# EasyEDA Pro project Internal Chamber vr1.3.eprj

# Schematic _autosave-Internal Chamber
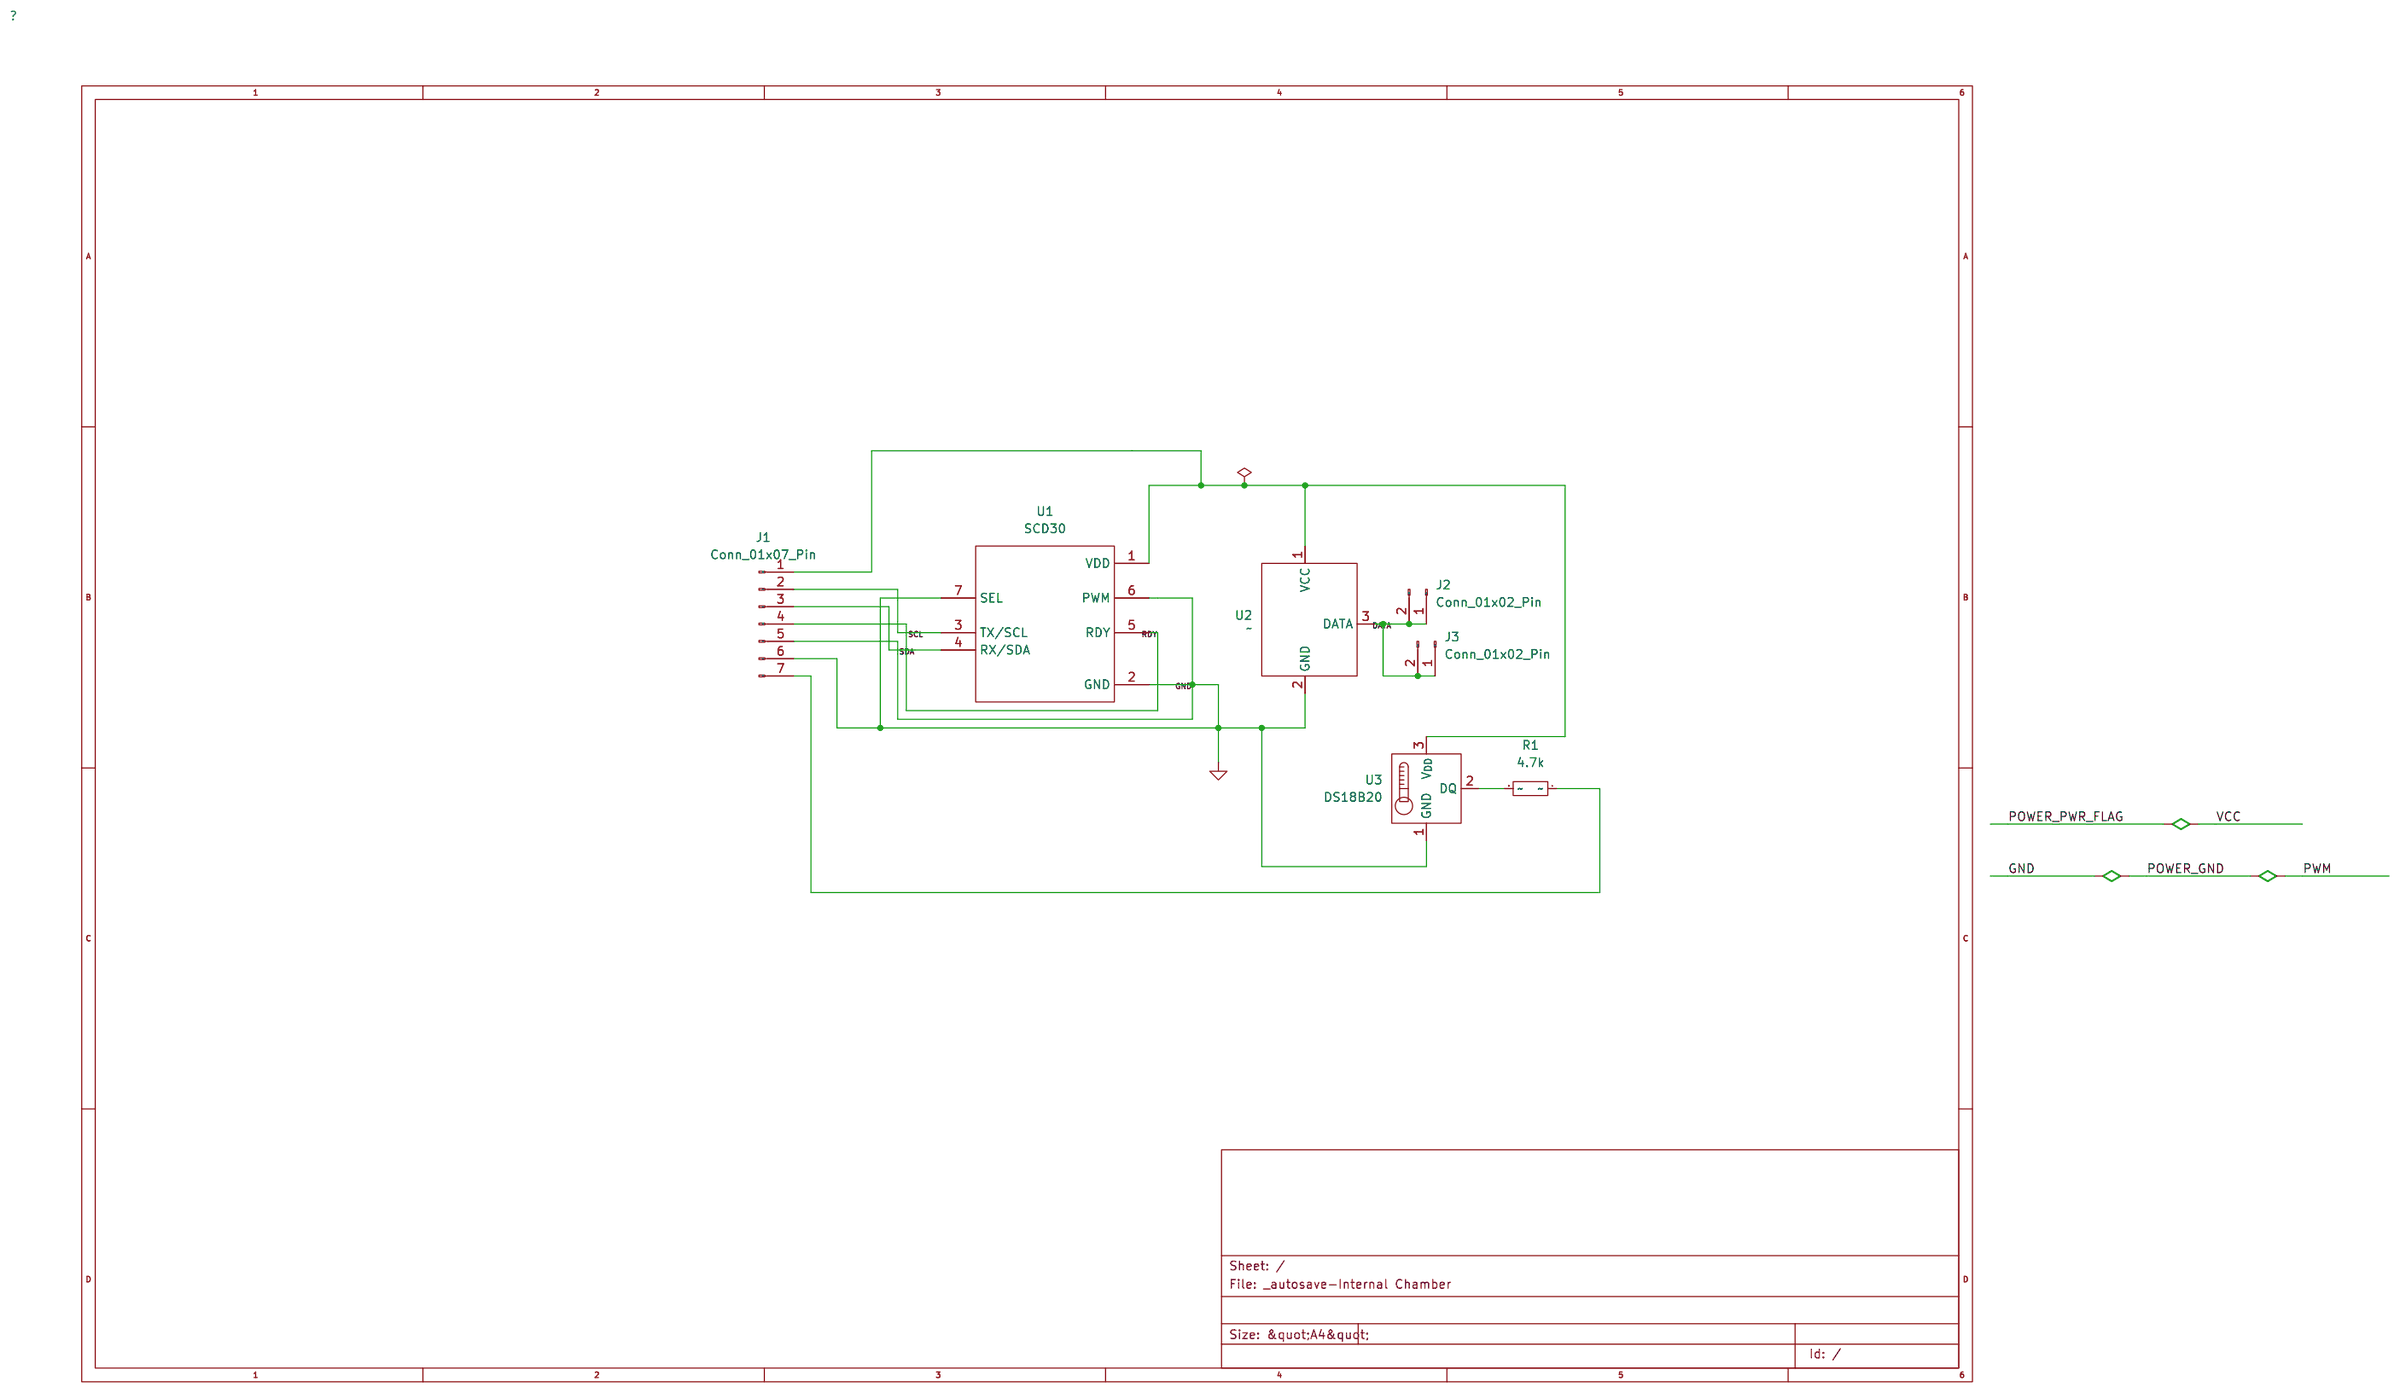
[diagram p0: schematic sheet]

## Parts
J1  Conn_01x07_Pin  [Connector_PinHeader_2.54mm:PinHeader_1x07_P2.54mm_Vertical]
J2  Conn_01x02_Pin  [Connector_PinSocket_2.54mm:PinSocket_1x02_P2.54mm_Vertical]
J3  Conn_01x02_Pin  [Connector_PinSocket_2.54mm:PinSocket_1x02_P2.54mm_Vertical]
R1  4.7k  [Resistor_THT:R_Axial_DIN0207_L6.3mm_D2.5mm_P15.24mm_Horizontal]
U1  SCD30  [SCD30 Footprint:MODULE_SCD30]
U2  -  [CO2_Sensor_IDE]
U3  DS18B20  [Package_TO_SOT_THT:TO-92_Inline]

## Library data of the parts
J1 = Connector_Conn_01x07_Pin: Generic connector, single row, 01x07, script generated
J2 J3 = Connector_Conn_01x02_Pin: Generic connector, single row, 01x02, script generated
R1 = Device_R: Resistor
U1 = SCD30_SCD30: MF: Sensirion AG; MAXIMUM_PACKAGE_HEIGHT: 7.0mm; Price: None; Check_prices: https://www.snapeda.com/parts/SCD30/Sensirion+AG/view-part/?ref=eda; STANDARD: Manufacturer Recommendations; PARTREV: D1; SnapEDA_Link: https://www.snapeda.com/parts/SCD30/Sensirion+AG/view-part/?ref=snap; Description_1: \n                        \n                            Carbon Dioxide (CO2), Humidity, Temperature Sensor I2C, Modbus, PWM\n                        \n; Availability: In Stock; MANUFACTURER: Sensirion
U2 = CO2_Sensor_IDE_CO2-Sensor-IDE
U3 = Sensor_Temperature_DS18B20: Programmable Resolution 1-Wire Digital Thermometer TO-92; User doc link: http://datasheets.maximintegrated.com/en/ds/DS18B20.pdf

## Nets
DATA: J2.1(Pin) J2.2(Pin) J3.1(Pin) J3.2(Pin) U2.3(DATA)
POWER_GND: J1.5(Pin) J1.6(Pin) U1.2(GND) U1.6(PWM) U1.7(SEL) U2.2(GND) U3.1(GND)
POWER_PWR_FLAG: J1.1(Pin) U1.1(VDD) U2.1(VCC) U3.3(V_{DD})
RDY: J1.4(Pin) U1.5(RDY)
SCL: J1.2(Pin) U1.3(TX/SCL)
SDA: J1.3(Pin) U1.4(RX/SDA)
Net-(J1-7): J1.7(Pin) R1.1
Net-(R1-2): R1.2 U3.2(DQ)

# Schematic Internal Chamber
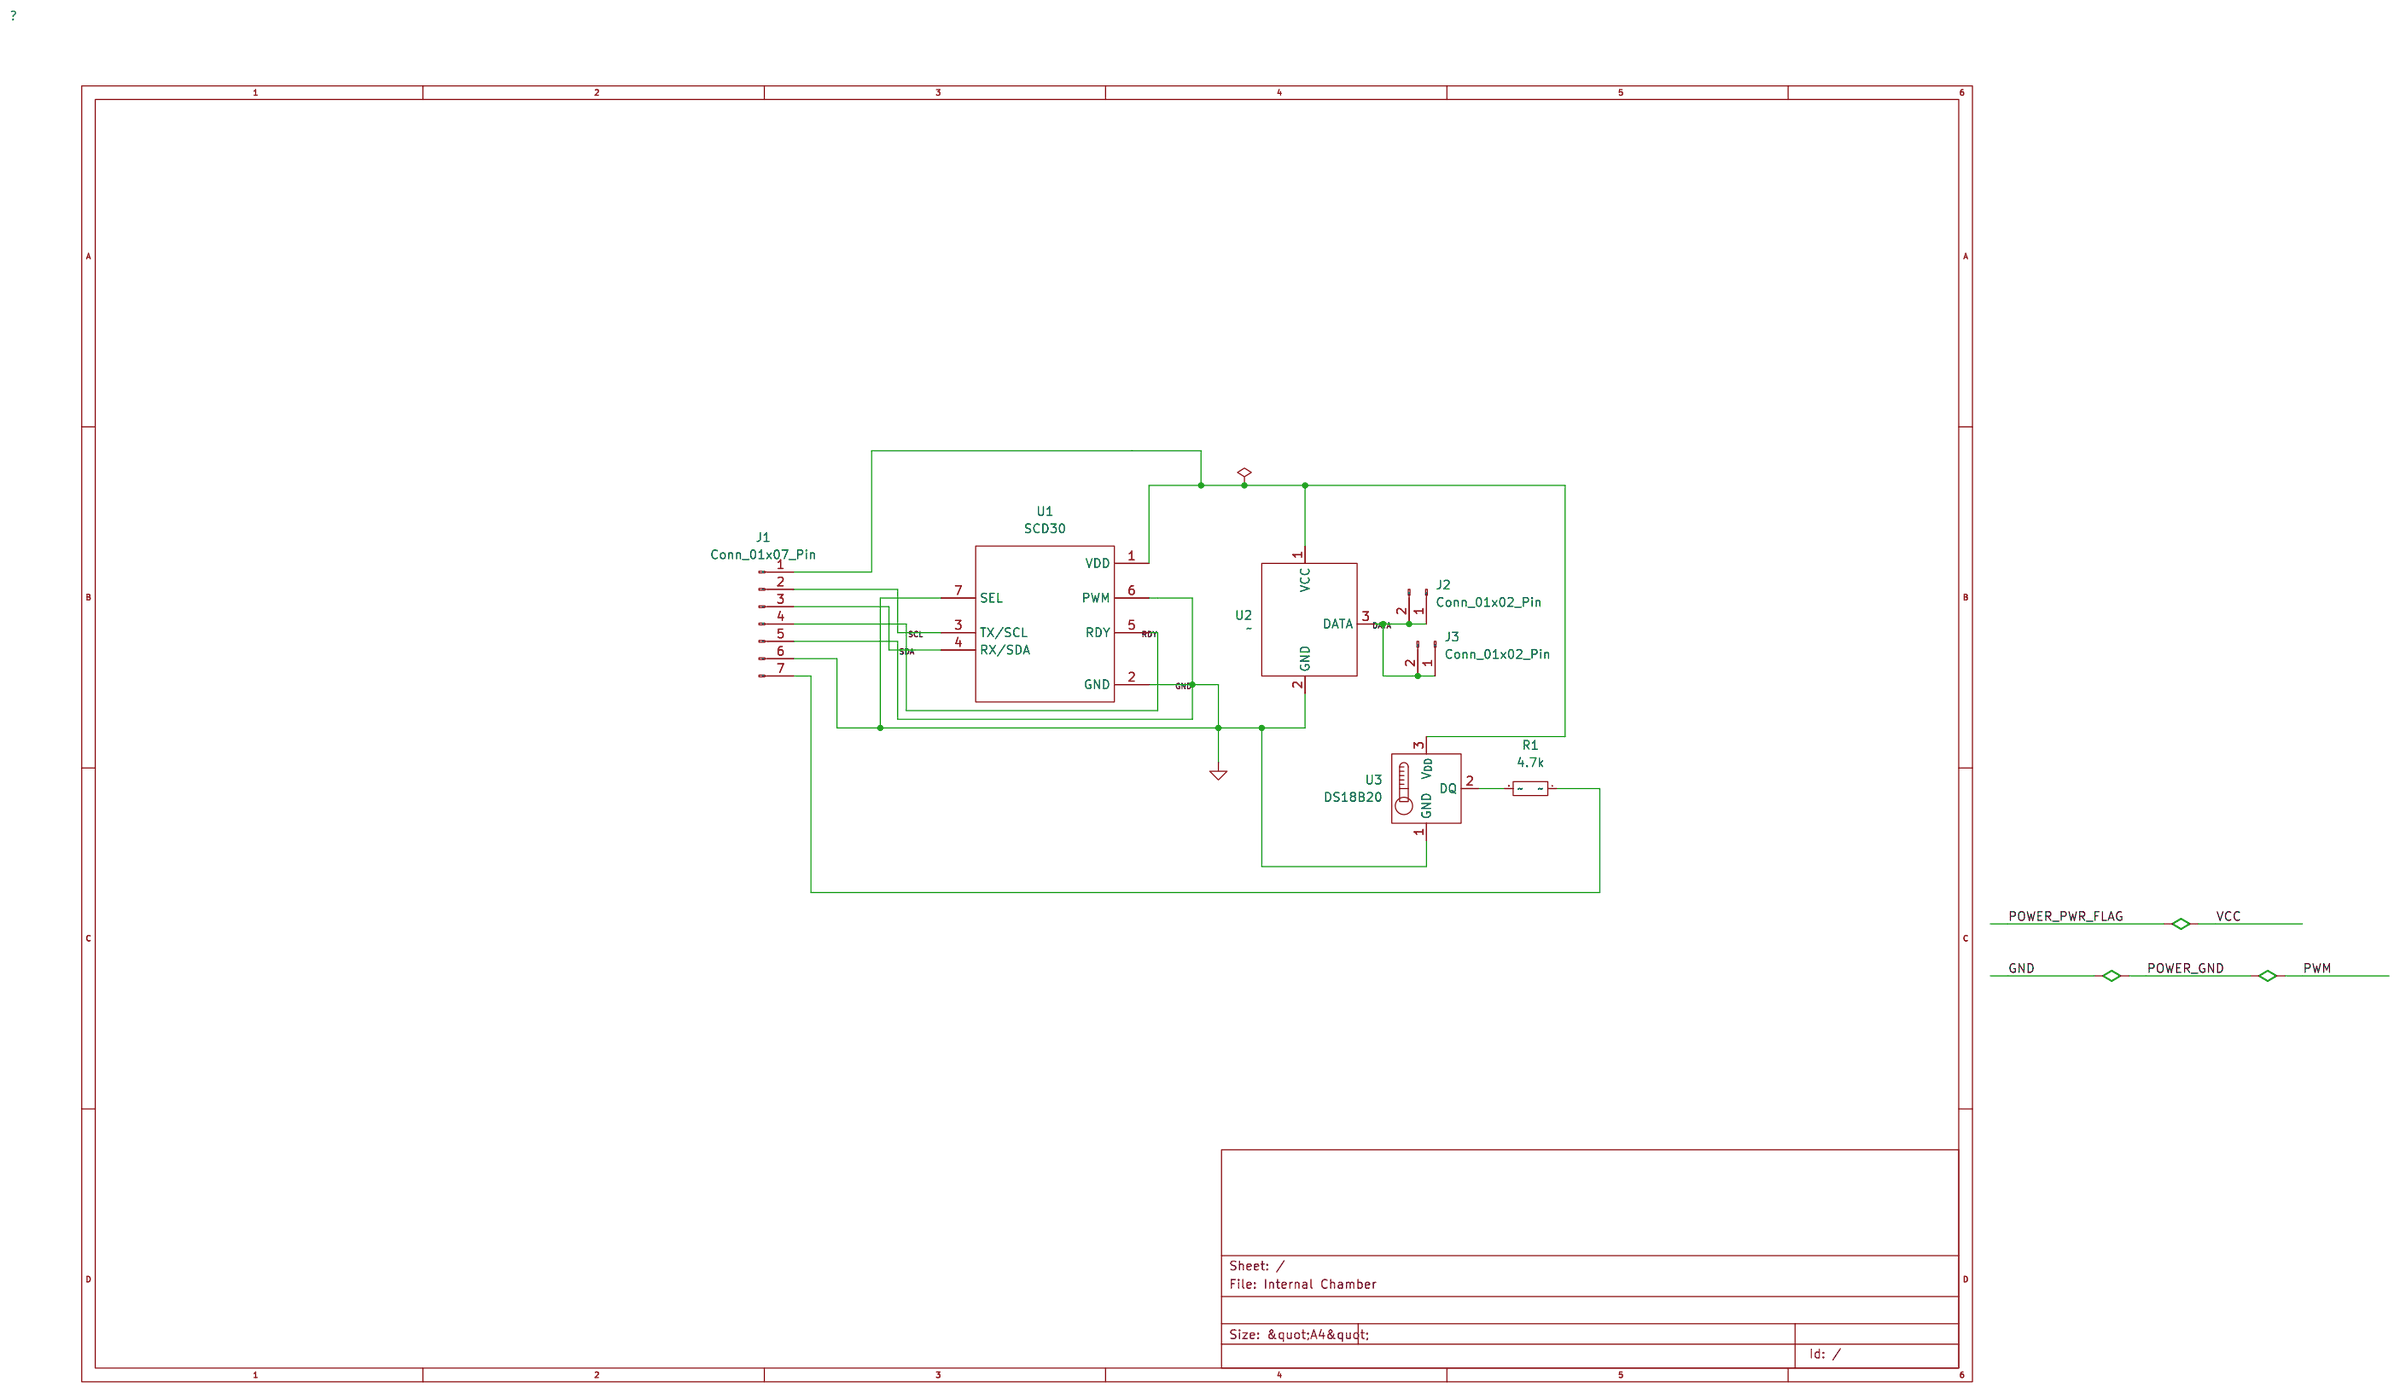
[diagram p1: schematic sheet]

## Parts
J1  Conn_01x07_Pin  [Connector_PinHeader_2.54mm:PinHeader_1x07_P2.54mm_Vertical]
J2  Conn_01x02_Pin  [Connector_PinSocket_2.54mm:PinSocket_1x02_P2.54mm_Vertical]
J3  Conn_01x02_Pin  [Connector_PinSocket_2.54mm:PinSocket_1x02_P2.54mm_Vertical]
R1  4.7k  [Resistor_THT:R_Axial_DIN0207_L6.3mm_D2.5mm_P15.24mm_Horizontal]
U1  SCD30  [SCD30 Footprint:MODULE_SCD30]
U2  -  [CO2_Sensor_IDE]
U3  DS18B20  [Package_TO_SOT_THT:TO-92_Inline]

## Library data of the parts
J1 = Connector_Conn_01x07_Pin: Generic connector, single row, 01x07, script generated
J2 J3 = Connector_Conn_01x02_Pin: Generic connector, single row, 01x02, script generated
R1 = Device_R: Resistor
U1 = SCD30_SCD30: MF: Sensirion AG; MAXIMUM_PACKAGE_HEIGHT: 7.0mm; Price: None; Check_prices: https://www.snapeda.com/parts/SCD30/Sensirion+AG/view-part/?ref=eda; STANDARD: Manufacturer Recommendations; PARTREV: D1; SnapEDA_Link: https://www.snapeda.com/parts/SCD30/Sensirion+AG/view-part/?ref=snap; Description_1: \n                        \n                            Carbon Dioxide (CO2), Humidity, Temperature Sensor I2C, Modbus, PWM\n                        \n; Availability: In Stock; MANUFACTURER: Sensirion
U2 = CO2_Sensor_IDE_CO2-Sensor-IDE
U3 = Sensor_Temperature_DS18B20: Programmable Resolution 1-Wire Digital Thermometer TO-92; User doc link: http://datasheets.maximintegrated.com/en/ds/DS18B20.pdf

## Nets
DATA: J2.1(Pin) J2.2(Pin) J3.1(Pin) J3.2(Pin) U2.3(DATA)
POWER_GND: J1.5(Pin) J1.6(Pin) U1.2(GND) U1.6(PWM) U1.7(SEL) U2.2(GND) U3.1(GND)
POWER_PWR_FLAG: J1.1(Pin) U1.1(VDD) U2.1(VCC) U3.3(V_{DD})
RDY: J1.4(Pin) U1.5(RDY)
SCL: J1.2(Pin) U1.3(TX/SCL)
SDA: J1.3(Pin) U1.4(RX/SDA)
NET-(J1-PIN_7): J1.7(Pin) R1.1
NET-(U3-DQ): R1.2 U3.2(DQ)

# Board Internal Chamber
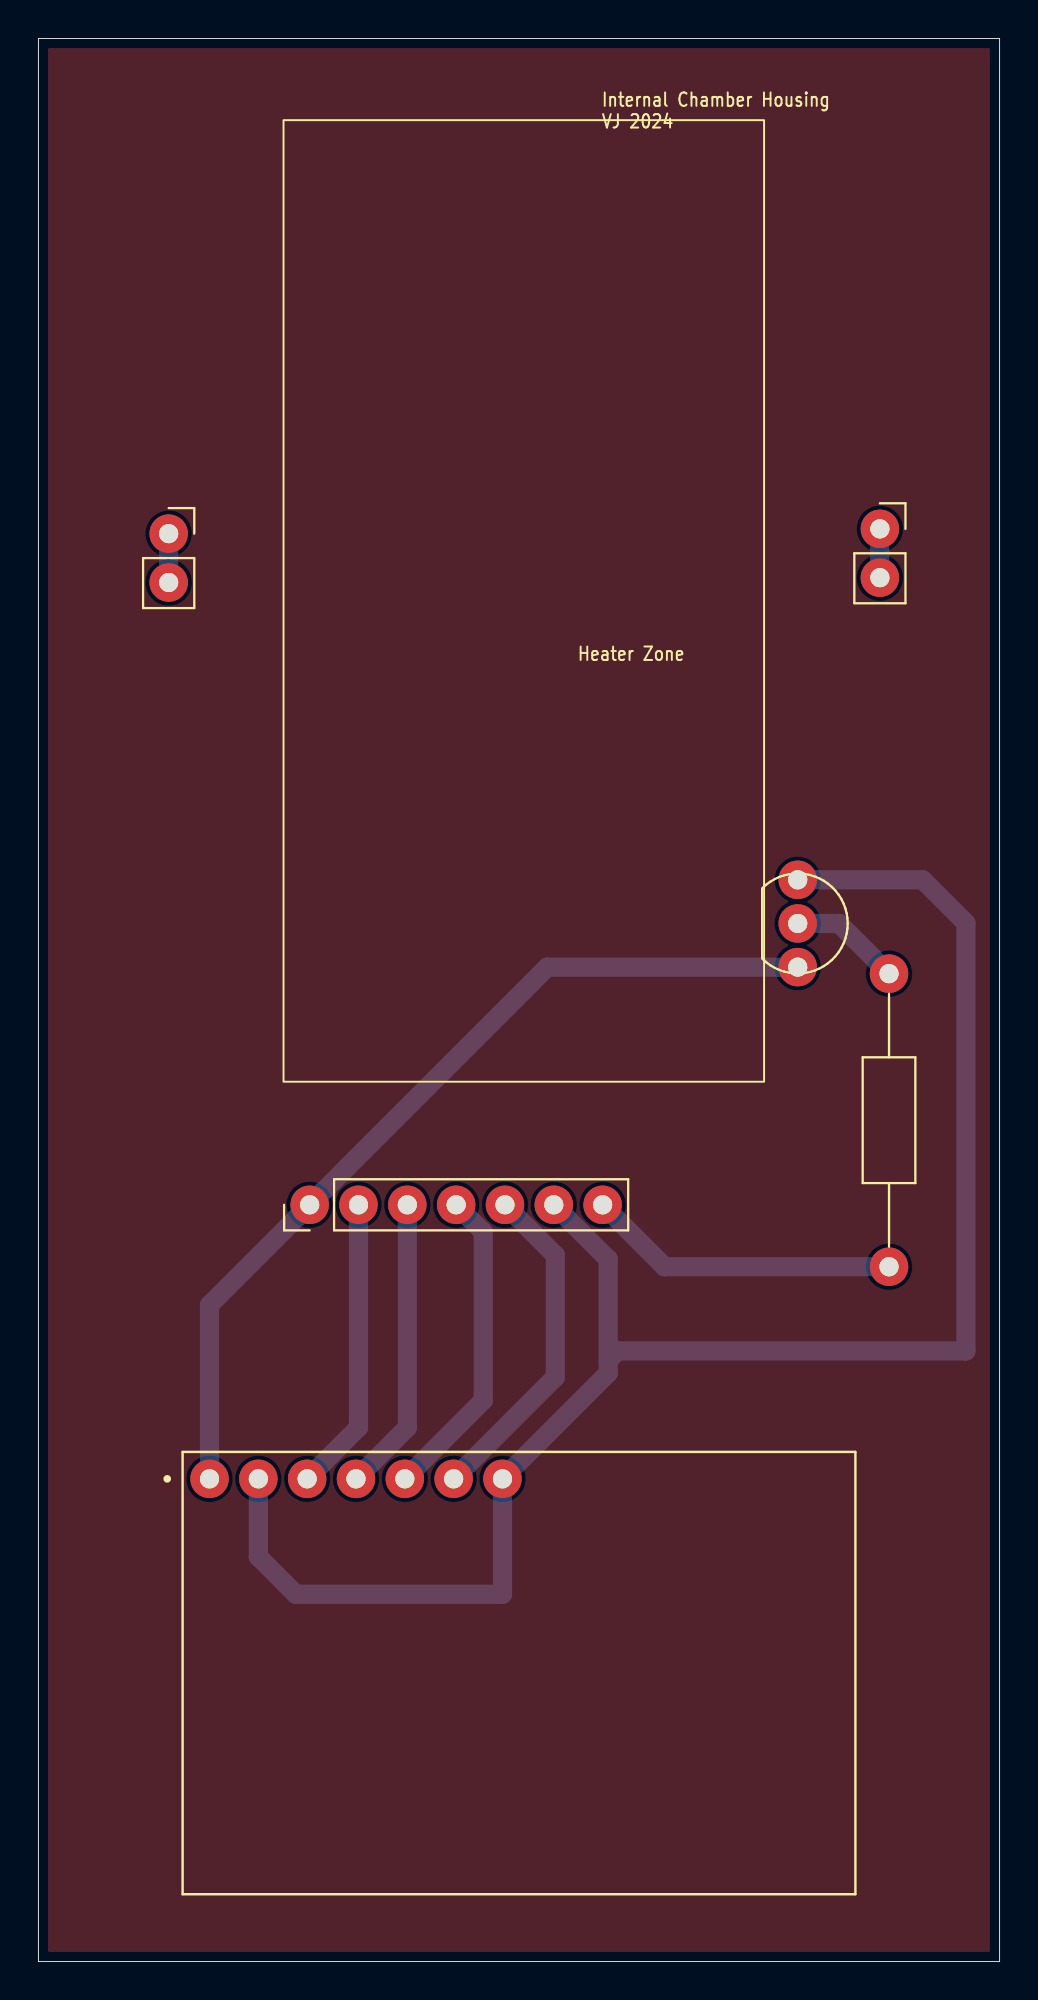
[diagram p2: board, top side]
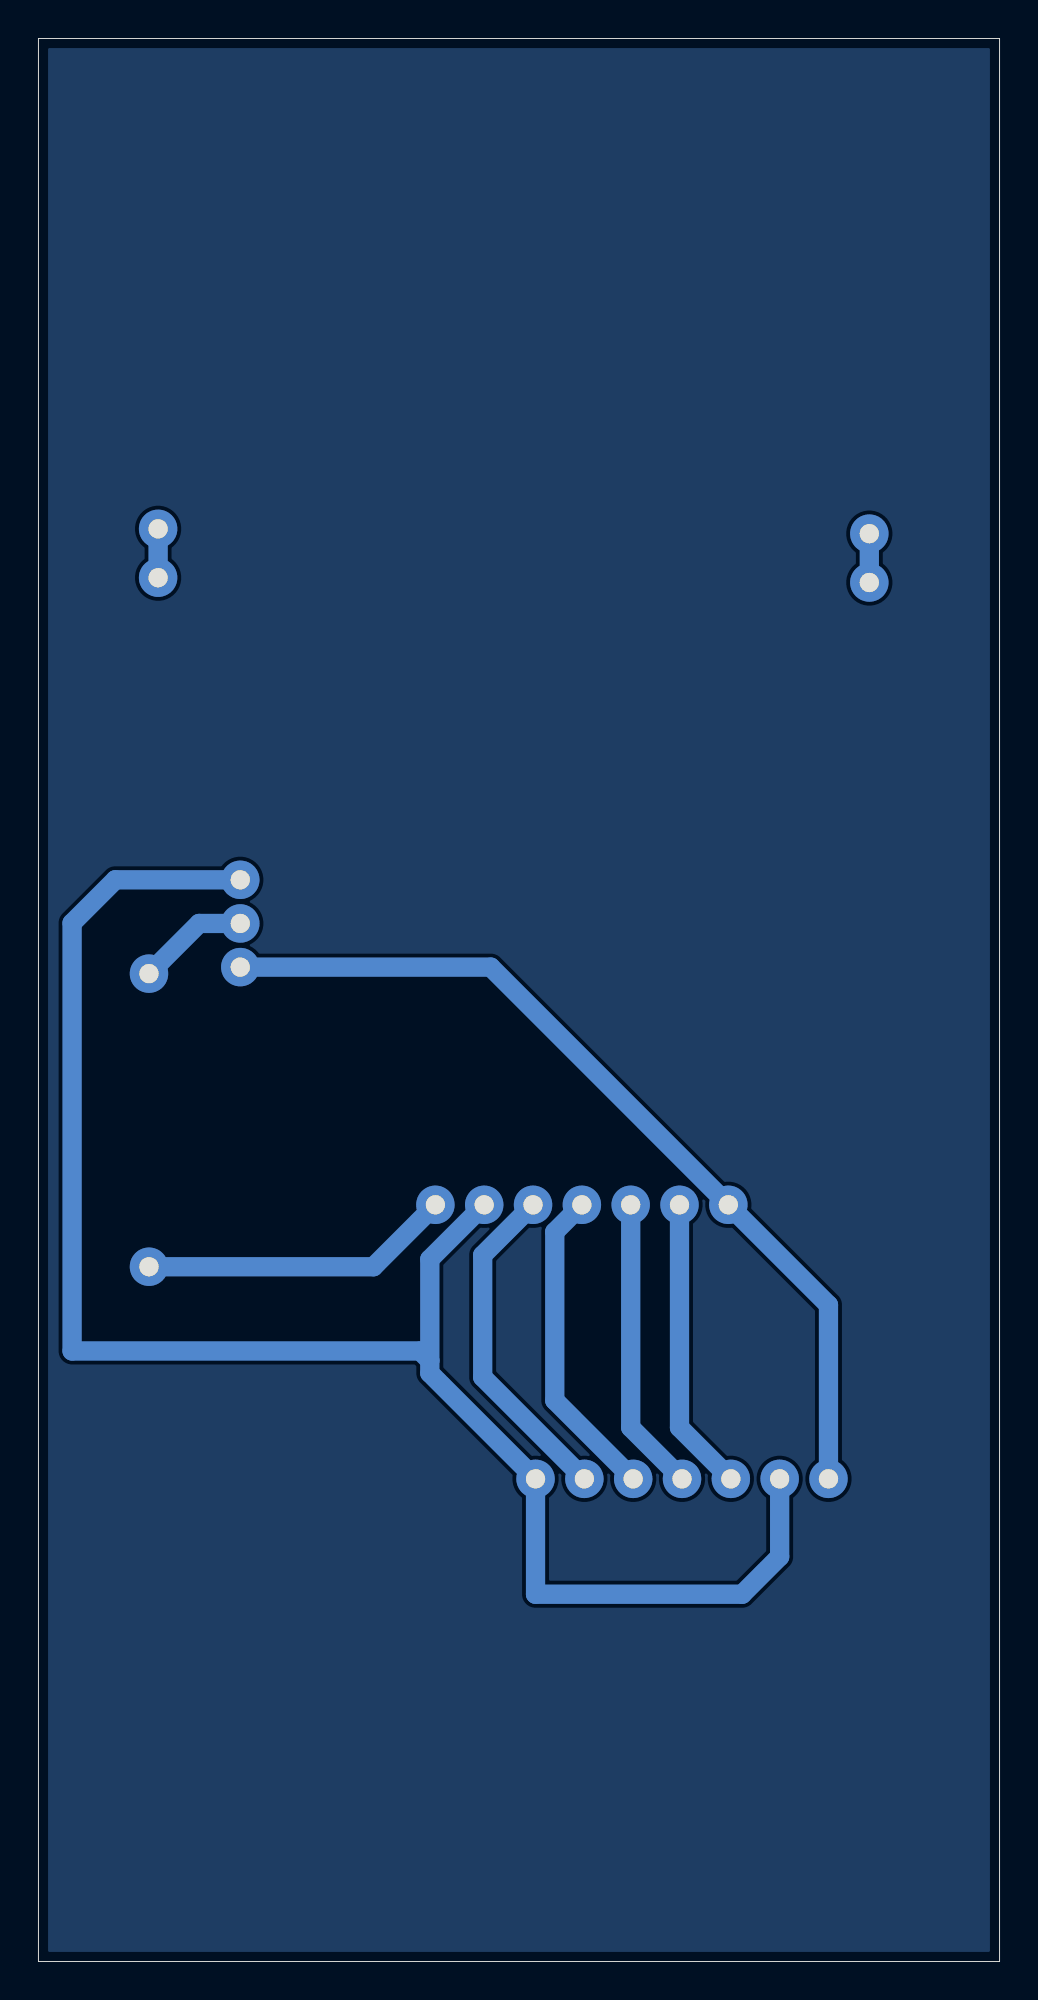
[diagram p3: board, bottom side, seen from below]

Outline 50 x 100 mm; copper layers: Top Layer, Bottom Layer. Coordinates in mm from the lower left corner of the outline.
Outline path: 0,100 50,100 50,0 0,0 0,100
Stack: Top Layer 0.0009mm / dielectric 1 0.0384mm FR4 er 4.5 / Bottom Layer 0.0009mm

## Design rules (mm)
spacing safeClearance (default): track to track 0.15, other pairs 0 to 0.15
track width trackWidth (default): min 0.127, default 0.254, max 2.54
differential pair differentialPair (default): width min 0.127, default 0.254, max 2.54; gap min 0.152, default 0.152
via viaSize (default): diameter min 0.5, default 0.61, max 10; hole min 0.3, default 0.305, max 6

## Placement (name value [footprint] x y rotation side)
J1  Conn_01x07_Pin  [Connector_PinHeader_2.54mm:PinHeader_1x07_P2.54mm_Vertical]  14.11 39.35 90 top
J2  Conn_01x02_Pin  [Connector_PinSocket_2.54mm:PinSocket_1x02_P2.54mm_Vertical]  43.78 74.5 0 top
J3  Conn_01x02_Pin  [Connector_PinSocket_2.54mm:PinSocket_1x02_P2.54mm_Vertical]  6.78 74.25 0 top
R1  4.7k  [Resistor_THT:R_Axial_DIN0207_L6.3mm_D2.5mm_P15.24mm_Horizontal]  44.25 36.13 90 top
U1  SCD30  [SCD30 Footprint:MODULE_SCD30]  25 15 0 top
U3  DS18B20  [Package_TO_SOT_THT:TO-92_Inline]  39.5 55.25 270 top

## Footprints (pads in the part's own frame, mm; a bottom-side part is the same pattern mirrored in y, then rotated)
Connector_PinHeader_2.54mm:PinHeader_1x07_P2.54mm_Vertical
  round 2 hole 1: 1(0,0) 2(0,-2.54) 3(0,-5.08) 4(0,-7.62) 5(0,-10.16) 6(0,-12.7) 7(0,-15.24)
Connector_PinSocket_2.54mm:PinSocket_1x02_P2.54mm_Vertical
  round 2 hole 1: 1(0,0) 2(0,-2.54)
Package_TO_SOT_THT:TO-92_Inline
  round 2 hole 1: 1(-1,0) 2(1.27,0) 3(3.54,0)
Resistor_THT:R_Axial_DIN0207_L6.3mm_D2.5mm_P15.24mm_Horizontal
  round 2 hole 1: 1(0,0) 2(15.24,0)
SCD30 Footprint:MODULE_SCD30
  round 2 hole 1x1.1: 1(-16.1,10.1) 2(-13.56,10.1) 3(-11.02,10.1) 4(-8.48,10.1) 5(-5.94,10.1) 6(-3.4,10.1) 7(-0.86,10.1)

## Nets
/VCC: J1.1 U1.1 U3.3
GND: J1.6 U1.2 U1.7 U3.1
/DATA: J2.1 J2.2 J3.1 J3.2
/PWM: J1.5 U1.6
/RDY: J1.4 U1.5
/SCL: J1.2 U1.3
/SDA: J1.3 U1.4
NET-(J1-PIN_7): J1.7 R1.1
NET-(U3-DQ): R1.2 U3.2

## Routing (per net, layer and track width the routed paths; a pad name or vN(x,y) marks a point on that pad's centre or on a via; arc(x,y) is an arc through that point)
/VCC: length 46.9
  Bottom Layer w1: U1.1 8.9,34.14 J1.1 26.47,51.71 U3.3
GND: length 92
  Bottom Layer w1: 29.64,31.25 29.64,30.6 U1.7 24.14,19.1 13.39,19.1 11.44,21.05 U1.2 ; 29.64,31.25 30.14,31.75 48.25,31.75 48.25,54 46,56.25 U3.1 ; 29.64,31.25 29.64,36.52 J1.6
/DATA: length 5.1
  Bottom Layer w1: J2.1 J2.2 ; J3.1 J3.2
/PWM: length 17.5
  Bottom Layer w1: U1.6 26.89,30.39 26.89,36.73 J1.5
/RDY: length 16.5
  Bottom Layer w1: U1.5 23.14,29.18 23.14,37.94 21.73,39.35
/SCL: length 15.4
  Bottom Layer w1: J1.2 16.65,27.77 U1.3
/SDA: length 15.4
  Bottom Layer w1: 19.19,39.35 19.19,27.77 U1.4
NET-(J1-PIN_7): length 16.2
  Bottom Layer w1: R1.1 32.57,36.13 29.35,39.35
NET-(U3-DQ): length 5.8
  Bottom Layer w1: R1.2 41.64,53.98 39.5,53.98

## Copper pours and planes (outline as drawn; the poured copper is in the pictures)
(no net) on Top Layer: -2.5,103 52.25,103.25 52.75,-4.25 -4.5,-3.75
(no net) on Bottom Layer: -2.5,103 52.25,103.25 52.75,-4.25 -4.5,-3.75

## Text on the board
Top Silkscreen Layer: Heater Zone | Internal Chamber Housing / VJ 2024
